# Altium schematic sheet STM32开发板.SchDoc
size A4
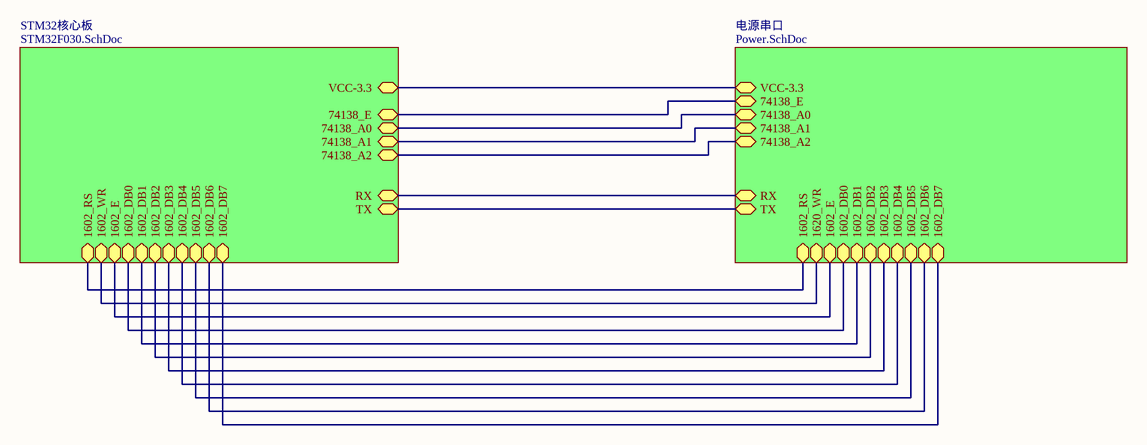
[diagram p0: STM32开发板.SchDoc]

## Sub-sheets
STM32核心板 = STM32F030.SchDoc: VCC-3.3, 74138_E, 74138_A0, 74138_A1, 74138_A2, 1602_RS, 1602_WR, 1602_DB0, 1602_DB1, 1602_DB2, 1602_DB4, 1602_DB5, 1602_DB6, 1602_DB3, 1602_E, 1602_DB7, RX, TX
电源串口 = Power.SchDoc: VCC-3.3, 74138_E, 74138_A0, 74138_A1, 74138_A2, 1602_RS, 1620_WR, 1602_E, 1602_DB0, 1602_DB1, 1602_DB2, 1602_DB3, 1602_DB4, 1602_DB5, 1602_DB6, 1602_DB7, RX, TX

## Nets
(unnamed): sheet STM32核心板/VCC-3.3, sheet 电源串口/VCC-3.3
(unnamed): sheet STM32核心板/74138_E, sheet 电源串口/74138_E
(unnamed): sheet STM32核心板/74138_A0, sheet 电源串口/74138_A0
(unnamed): sheet STM32核心板/74138_A1, sheet 电源串口/74138_A1
(unnamed): sheet STM32核心板/74138_A2, sheet 电源串口/74138_A2
(unnamed): sheet STM32核心板/1602_RS, sheet 电源串口/1602_RS
(unnamed): sheet STM32核心板/1602_WR, sheet 电源串口/1620_WR
(unnamed): sheet STM32核心板/1602_DB0, sheet 电源串口/1602_DB0
(unnamed): sheet STM32核心板/1602_DB1, sheet 电源串口/1602_DB1
(unnamed): sheet STM32核心板/1602_DB2, sheet 电源串口/1602_DB2
(unnamed): sheet STM32核心板/1602_DB4, sheet 电源串口/1602_DB4
(unnamed): sheet STM32核心板/1602_DB5, sheet 电源串口/1602_DB5
(unnamed): sheet STM32核心板/1602_DB6, sheet 电源串口/1602_DB6
(unnamed): sheet STM32核心板/1602_DB3, sheet 电源串口/1602_DB3
(unnamed): sheet STM32核心板/1602_E, sheet 电源串口/1602_E
(unnamed): sheet STM32核心板/1602_DB7, sheet 电源串口/1602_DB7
(unnamed): sheet STM32核心板/RX, sheet 电源串口/RX
(unnamed): sheet STM32核心板/TX, sheet 电源串口/TX